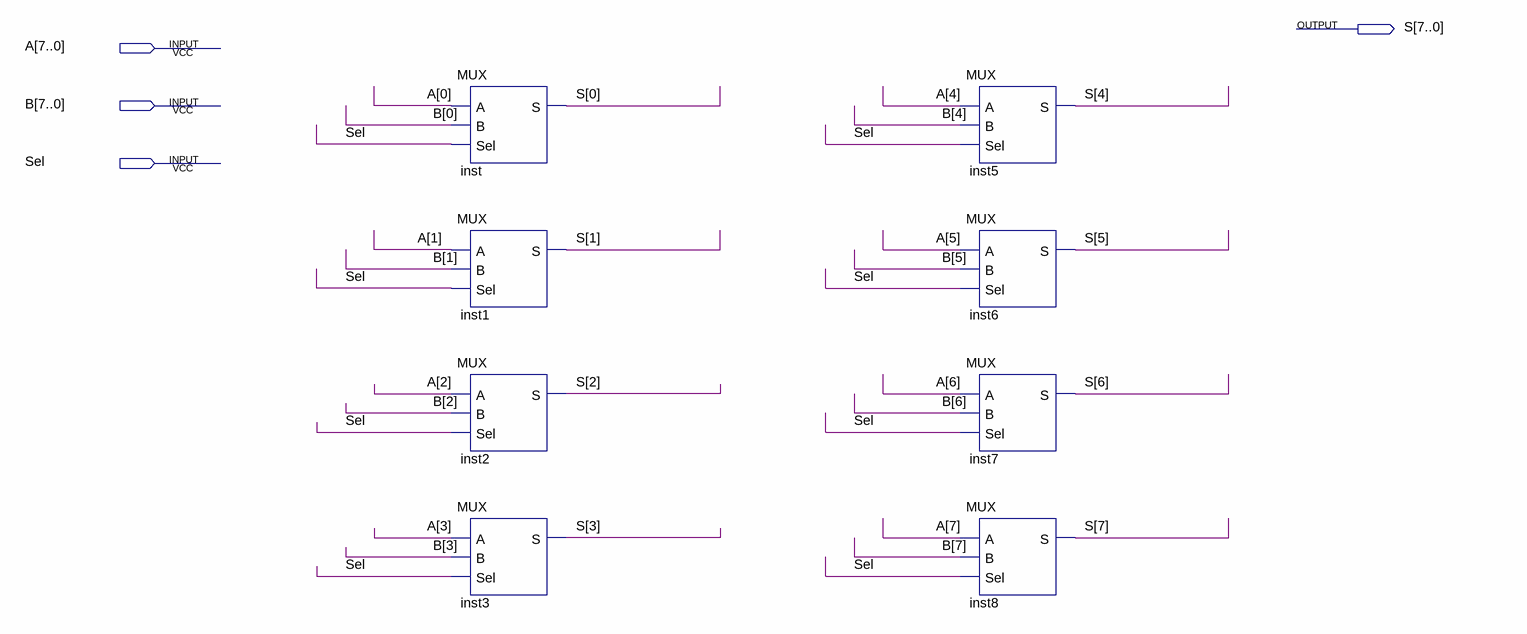
[diagram p0: schematic sheet]
// Quartus schematic MUX8bit.bdf as structural Verilog: 8 symbols, 4 pins
module MUX8bit (
  input  [7:0] A,
  input  [7:0] B,
  input  Sel,
  output [7:0] S
);

  MUX inst (.A(A[0]), .B(B[0]), .Sel(Sel), .S(S[0]));
  MUX inst1 (.A(A[1]), .B(B[1]), .Sel(Sel), .S(S[1]));
  MUX inst2 (.A(A[2]), .B(B[2]), .Sel(Sel), .S(S[2]));
  MUX inst3 (.A(A[3]), .B(B[3]), .Sel(Sel), .S(S[3]));
  MUX inst5 (.A(A[4]), .B(B[4]), .Sel(Sel), .S(S[4]));
  MUX inst6 (.A(A[5]), .B(B[5]), .Sel(Sel), .S(S[5]));
  MUX inst7 (.A(A[6]), .B(B[6]), .Sel(Sel), .S(S[6]));
  MUX inst8 (.A(A[7]), .B(B[7]), .Sel(Sel), .S(S[7]));
endmodule
